# EAGLE schematic BOSS-RoboClaw-Breakout (EAGLE 9.6.2)
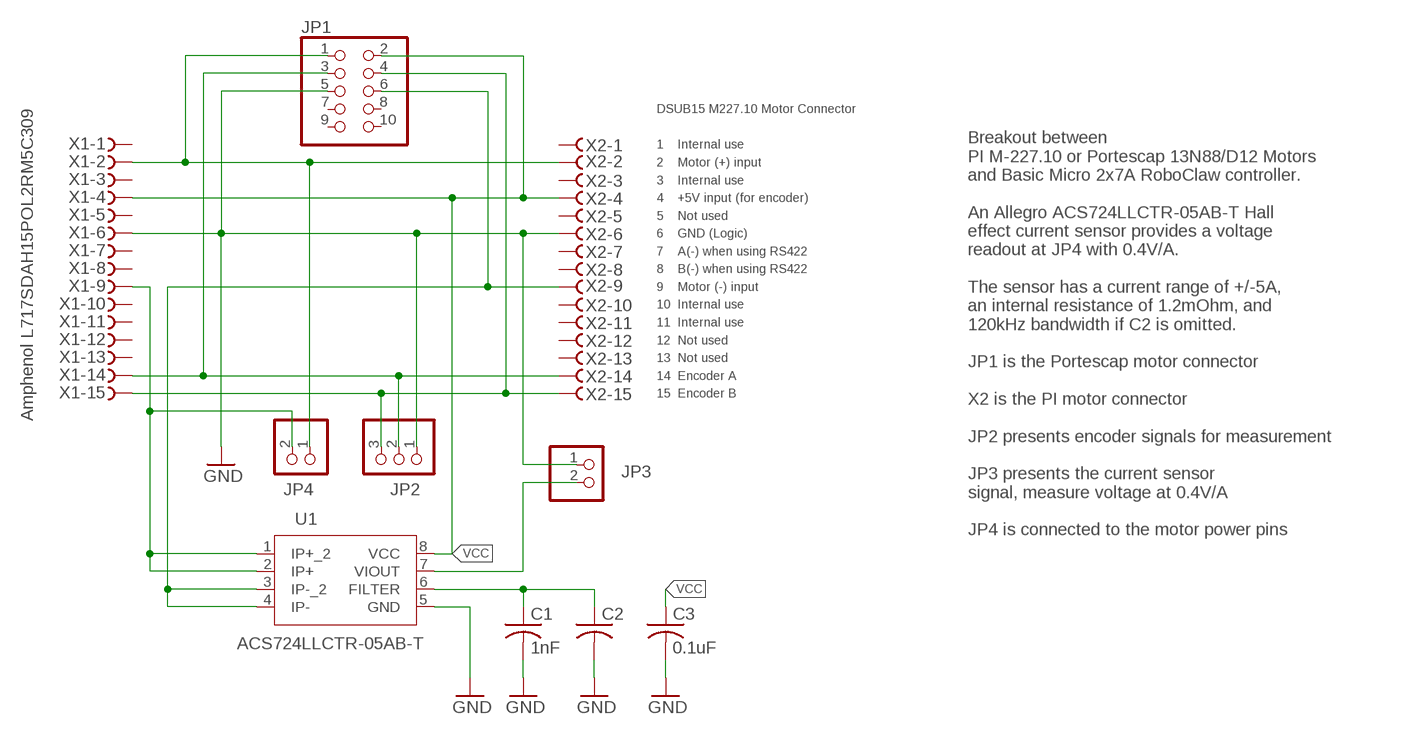
[diagram p0: schematic, sheet 1]

## Parts
C1  1nF  C-USC0805  [C0805]
C2  C-USC0805  [C0805]
C3  0.1uF  C-USC0805  [C0805]
JP1  PINHD-2X5  [2X05]
JP2  PINHD-1X3  [1X03]
JP3  PINHD-1X2  [1X02]
JP4  PINHD-1X2  [1X02]
U1  ACS724LLCTR-05AB-T  CURRENTSENSOR-ACS724LLCTR-05AB-T  [IC8_ACS724LLCTR-05AB-T_ALM]
X1  Amphenol L717SDAH15POL2RM5C309  D-SUB15-H2M15ST  [H2M15ST]
X2  Amphenol L77SDAH15SOL2RM8C309  D-SUB15-H2R15ST  [H2R15ST]

## Nets
ENCA: JP1.3 JP2.2 X1.14 X2.14
ENCB: JP1.4 JP2.3 X1.15 X2.15
FILTER: C1.1 C2.1 U1.6(FILTER)
GND: C1.2 C2.2 C3.2 JP1.5 JP2.1 JP3.1 U1.5(GND) X1.6 X2.6
M+: JP1.1 JP4.1 X1.2 X2.2
M-: JP1.6 U1.3(IP-_2) U1.4(IP-) X2.9
N$5: JP4.2 U1.1(IP+_2) U1.2(IP+) X1.9
VCC: C3.1 JP1.2 U1.8(VCC) X1.4 X2.4
VIOUT: JP3.2 U1.7(VIOUT)
Unconnected: JP1.7 JP1.8 JP1.9 JP1.10 X1.1 X1.3 X1.5 X1.7 X1.8 X1.10 X1.11 X1.12 X1.13 X2.1 X2.3 X2.5 X2.7 X2.8 X2.10 X2.11 X2.12 X2.13

## Notes on the sheet
- DSUB15 M227.10 Motor Connector
  
  1    Internal use
  2    Motor (+) input
  3    Internal use
  4    +5V input (for encoder)
  5    Not used
  6    GND (Logic)
  7    A(-) when using RS422
  8    B(-) when using RS422
  9    Motor (-) input
  10  Internal use
  11  Internal use
  12  Not used
  13  Not used
  14  Encoder A
  15  Encoder B
- Breakout between
  PI M-227.10 or Portescap 13N88/D12 Motors
  and Basic Micro 2x7A RoboClaw controller.
  
  An Allegro ACS724LLCTR-05AB-T Hall
  effect current sensor provides a voltage
  readout at JP4 with 0.4V/A.
  
  The sensor has a current range of +/-5A,
  an internal resistance of 1.2mOhm, and
  120kHz bandwidth if C2 is omitted.
  
  JP1 is the Portescap motor connector
  
  X2 is the PI motor connector
  
  JP2 presents encoder signals for measurement
  
  JP3 presents the current sensor
  signal, measure voltage at 0.4V/A
  
  JP4 is connected to the motor power pins

## Library data of the parts
C1-C3 = AUmlib:C-US: CAPACITOR, American symbol; SPICEPREFIX: C
JP1 = AUmlib:PINHD-2X5: PIN HEADER
JP2 = AUmlib:PINHD-1X3: PIN HEADER
JP3 JP4 = AUmlib:PINHD-1X2: PIN HEADER
U1 = AUmlib:CURRENTSENSOR-ACS724LLCTR-05AB-T; BUILT_BY: EMA_Kyle; COPYRIGHT: Copyright (C) 2018 Accelerated Designs. All rights reserved; DATASHEET: https://www.digikey.com/product-detail/en/allegro-microsystems/ACS724LLCTR-05AB-T/620-ACS724LLCTR-05AB-TTR-ND/5400755; MANUFACTURER_PART_NUMBER: ACS724LLCTR-05AB-T; SOURCELIBRARY: Allegro_Microsystems_Inc_2020-07-30; VENDOR: Allegro Microsystems Inc.
X1 X2 = AUmlib:D-SUB15-: D-Subminiatur Connector Source: Electronioc Interconnects European Edition 1998; OC_FARNELL: unknown; OC_NEWARK: unknown